# Altium schematic sheet PNPdriver.SchDoc
size A4
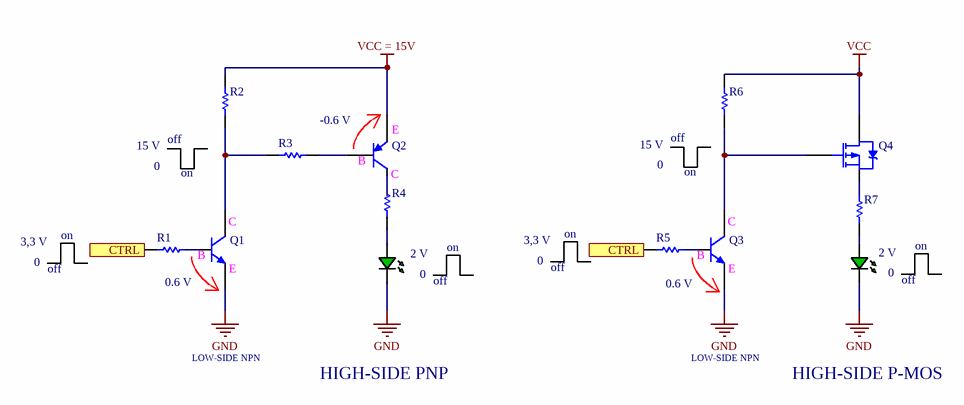
[diagram p0: PNPdriver.SchDoc]

## Parts
Q1  2N3904  [TO-92A]  (value not drawn)
Q2  2N3906  [TO-92A]  (value not drawn)
Q3  2N3904  [TO-92A]  (value not drawn)
Q4  PMOS  [TO-220AB]  (value not drawn)
R1  Res1  [AXIAL-0.3]  (value not drawn)
R2  Res1  [AXIAL-0.3]  (value not drawn)
R3  Res1  [AXIAL-0.3]  (value not drawn)
R4  Res1  [AXIAL-0.3]  (value not drawn)
R5  Res1  [AXIAL-0.3]  (value not drawn)
R6  Res1  [AXIAL-0.3]  (value not drawn)
R7  Res1  [AXIAL-0.3]  (value not drawn)
TS-OFF1  green  [3528_LED - duplicate1]  (value not drawn)
TS-OFF2  green  [3528_LED - duplicate1]  (value not drawn)

## Ports
CTRL (in)

## Nets
GND: Q1.1(E) Q3.1(E) TS-OFF1.K TS-OFF2.K
VCC: Q4.2(D) R6.1
VCC = 15V: Q2.1(E) R2.2
CTRL: R1.2 R5.2 ; port CTRL
NetQ1_2: Q1.2(B) R1.1
NetQ1_3: Q1.3(C) R2.1 R3.2
NetQ2_2: Q2.2(B) R3.1
NetQ2_3: Q2.3(C) R4.2
NetQ3_2: Q3.2(B) R5.1
NetQ3_3: Q3.3(C) Q4.1(G) R6.2
NetQ4_3: Q4.3(S) R7.2
NetR4_1: R4.1 TS-OFF1.A
NetR7_1: R7.1 TS-OFF2.A

## Notes on the sheet
- -0.6 V
- (near Q2) E
- 15 V
- 0
- (near R2) off
- on
- (near Q2) B
- C
- (near R6) off
- 3,3 V
- B
- (near Q1) C
- (near TS-OFF1) 2 V
- off
- (near Q3) C
- 2 V
- 0.6 V
- (near Q1) E
- (near TS-OFF1) 0
- (near TS-OFF1) off
- (near Q3) E
- (near TS-OFF2) 0
- LOW-SIDE NPN
- HIGH-SIDE PNP
- HIGH-SIDE P-MOS
- DWG. NO.
- REV.
- SHT.
- THIS DOCUMENT AND THE DATA DISCLOSED HEREIN OR HEREWITH IS THE PROPERTY OF ALTIUM LIMITED AND MAY BE FREELY DISTRIBUTED IN WHOLE. NO RIGHTS ARE RESERVED OR EXPRESS OR IMPLIED WARANTEE GIVEN.
- REVISION
- DESCRIPTION
- DATE
- APPROVED
- ENG:
- APPROVALS
- PROJECT
- DSN:
- CHK:
- REFERENCE DOCUMENTS
- PROJECT REVISION:
- TITLE
- DOCUMENT REVISION:
- DESIGN ITEM:
- BOM:
- FAB DWG:
- PCB DWG:
- ASSY DWG:
- SCALE:
- SIZE
- CAGE CODE
- FILE NAME
- DWG NO.
- SHEET
- OF
- REV

## Library data of the parts
Q1 Q3 = 2N3904: NPN General Purpose Amplifier; Published: 8-Jun-2000; LatestRevisionDate: 15-Jan-2003; LatestRevisionNote: PCB Footprint 'BCY-W3/D4.7' replaced; DatasheetVersion: 1997; PackageVersion: Sep-1998; PackageReference: TO-92A; Publisher: Altium Limited; PackageDescription: TO, Flat Index; 3 In-Line, Axial Leads; Body Dia. 4.5mm; Leads 0.51 x 0.48 mm (max); ComponentLink1Description: Manufacturer Link; ComponentLink1URL: http://www.fairchildsemi.com/; ComponentLink2Description: Datasheet; ComponentLink2URL: http://www.fairchildsemi.com/ds/2N%2F2N3904.pdf
Q2 = 2N3906: PNP General Purpose Amplifier; Published: 8-Jun-2000; LatestRevisionDate: 15-Jan-2003; LatestRevisionNote: PCB Footprint 'BCY-W3/D4.7' replaced; DatasheetVersion: 1997; PackageVersion: Sep-1998; PackageReference: TO-92A; Publisher: Altium Limited; PackageDescription: TO, Flat Index; 3 In-Line, Axial Leads; Body Dia. 4.5mm; Leads 0.51 x 0.48 mm (max); ComponentLink1Description: Manufacturer Link; ComponentLink1URL: http://www.fairchildsemi.com/; ComponentLink2Description: Datasheet; ComponentLink2URL: http://www.fairchildsemi.com/ds/2N%2F2N3906.pdf
Q4 = PMOS-2: P-Channel Power MOSFET; Note: Pin 4 not drawn and electrically connected to Pin 2.; Published: 8-Jun-2000; LatestRevisionDate: 17-Jul-2002; LatestRevisionNote: Re-released for DXP Platform.; DatasheetVersion: PD-9.390D; PackageVersion: Feb-1997; PackageReference: TO-220AB; Publisher: Altium Limited; PackageDescription: TO, Thru-Hole, Vertical, Heatsink Mounted; 3 In-Line Leads; Pitch 2.54 mm; ComponentLink1Description: Manufacturer Link; ComponentLink1URL: http://www.irf.com/
R1-R7 = Res1: Resistor; Published: 8-Jun-2000; LatestRevisionDate: 17-Jul-2002; LatestRevisionNote: Re-released for DXP Platform.; PackageReference: AXIAL-0.3; Publisher: Altium Limited; PackageDescription: Axial Device, Thru-Hole; 2 Leads; 0.3 in Pin Spacing
TS-OFF1 TS-OFF2 = LEDG_0805